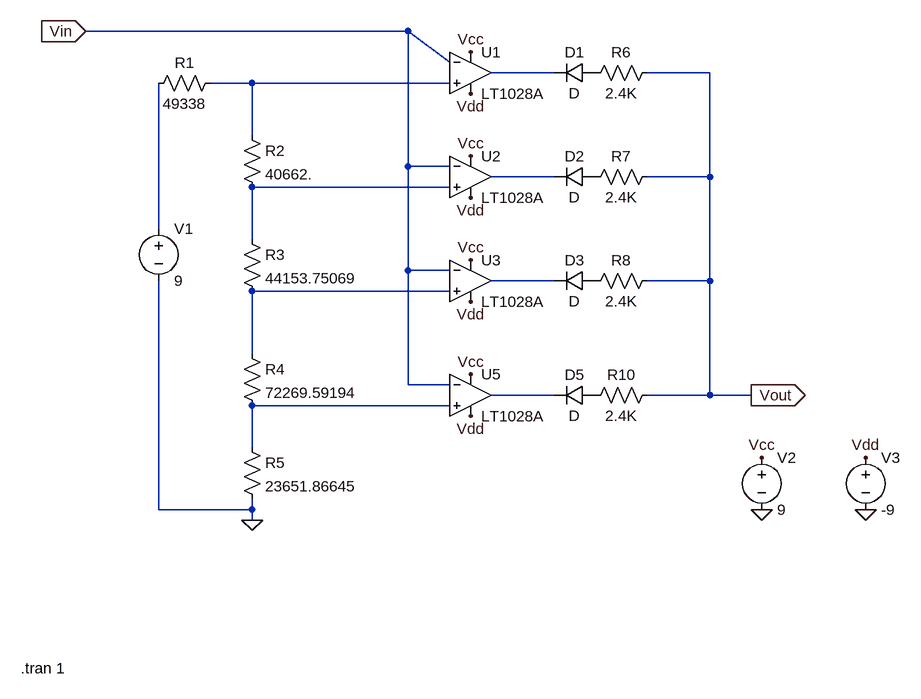
[diagram p0: schematic Komparator.asc]
Komparator.asc, the LTspice schematic file:
Version 4
SHEET 1 1284 996
WIRE 176 0 -320 0
WIRE 240 48 176 0
WIRE 400 64 304 64
WIRE 640 64 544 64
WIRE -64 80 -128 80
WIRE 240 80 -64 80
WIRE -64 160 -64 80
WIRE 176 208 176 0
WIRE 240 208 176 208
WIRE 400 224 304 224
WIRE 640 224 640 64
WIRE 640 224 544 224
WIRE 240 240 -64 240
WIRE -208 304 -208 80
WIRE -64 320 -64 240
WIRE 176 368 176 208
WIRE 240 368 176 368
WIRE 400 384 304 384
WIRE 640 384 640 224
WIRE 640 384 544 384
WIRE 240 400 -64 400
WIRE -64 496 -64 400
WIRE 176 544 176 368
WIRE 240 544 176 544
WIRE 400 560 304 560
WIRE 640 560 640 384
WIRE 640 560 544 560
WIRE 704 560 640 560
WIRE 240 576 -64 576
WIRE -64 640 -64 576
WIRE -208 736 -208 384
WIRE -64 736 -64 720
WIRE -64 736 -208 736
WIRE -64 752 -64 736
FLAG -64 752 0
FLAG -320 0 Vin
IOPIN -320 0 In
FLAG 272 32 Vcc
FLAG 272 192 Vcc
FLAG 272 352 Vcc
FLAG 272 528 Vcc
FLAG 720 656 Vcc
FLAG 272 592 Vdd
FLAG 272 416 Vdd
FLAG 272 256 Vdd
FLAG 272 96 Vdd
FLAG 704 560 Vout
IOPIN 704 560 Out
FLAG 720 736 0
FLAG 880 736 0
FLAG 880 656 Vdd
SYMBOL Opamps\\LT1028A 272 0 R0
SYMATTR InstName U1
SYMBOL Opamps\\LT1028A 272 160 R0
SYMATTR InstName U2
SYMBOL Opamps\\LT1028A 272 320 R0
SYMATTR InstName U3
SYMBOL Opamps\\LT1028A 272 496 R0
SYMATTR InstName U5
SYMBOL voltage -208 288 R0
WINDOW 123 0 0 Left 2
WINDOW 39 0 0 Left 2
SYMATTR InstName V1
SYMATTR Value 9
SYMBOL res -112 64 R90
WINDOW 0 0 56 VBottom 2
WINDOW 3 32 56 VTop 2
SYMATTR InstName R1
SYMATTR Value 49338
SYMBOL res -80 144 R0
SYMATTR InstName R2
SYMATTR Value 40662.
SYMBOL res -80 304 R0
SYMATTR InstName R3
SYMATTR Value 44153.75069
SYMBOL res -80 480 R0
SYMATTR InstName R4
SYMATTR Value 72269.59194
SYMBOL voltage 720 640 R0
WINDOW 123 0 0 Left 2
WINDOW 39 0 0 Left 2
SYMATTR InstName V2
SYMATTR Value 9
SYMBOL voltage 880 640 R0
WINDOW 123 0 0 Left 2
WINDOW 39 0 0 Left 2
SYMATTR InstName V3
SYMATTR Value -9
SYMBOL diode 464 48 R90
WINDOW 0 0 32 VBottom 2
WINDOW 3 32 32 VTop 2
SYMATTR InstName D1
SYMBOL diode 464 208 R90
WINDOW 0 0 32 VBottom 2
WINDOW 3 32 32 VTop 2
SYMATTR InstName D2
SYMBOL diode 464 368 R90
WINDOW 0 0 32 VBottom 2
WINDOW 3 32 32 VTop 2
SYMATTR InstName D3
SYMBOL diode 464 544 R90
WINDOW 0 0 32 VBottom 2
WINDOW 3 32 32 VTop 2
SYMATTR InstName D5
SYMBOL res 560 48 R90
WINDOW 0 0 56 VBottom 2
WINDOW 3 32 56 VTop 2
SYMATTR InstName R6
SYMATTR Value 2.4K
SYMBOL res 560 208 R90
WINDOW 0 0 56 VBottom 2
WINDOW 3 32 56 VTop 2
SYMATTR InstName R7
SYMATTR Value 2.4K
SYMBOL res 560 368 R90
WINDOW 0 0 56 VBottom 2
WINDOW 3 32 56 VTop 2
SYMATTR InstName R8
SYMATTR Value 2.4K
SYMBOL res 560 544 R90
WINDOW 0 0 56 VBottom 2
WINDOW 3 32 56 VTop 2
SYMATTR InstName R10
SYMATTR Value 2.4K
SYMBOL res -80 624 R0
SYMATTR InstName R5
SYMATTR Value 23651.86645
TEXT -420 980 Left 2 !.tran 1

The netlist it stands for:
* Komparator.asc
XU1 N002 Vin Vcc Vdd N001 LT1028A  ; pins In+ In- V+ V- OUT
XU2 N004 Vin Vcc Vdd N003 LT1028A  ; pins In+ In- V+ V- OUT
XU3 N007 Vin Vcc Vdd N006 LT1028A  ; pins In+ In- V+ V- OUT
XU5 N009 Vin Vcc Vdd N008 LT1028A  ; pins In+ In- V+ V- OUT
V1 N005 0 9
R1 N002 N005 49338
R2 N002 N004 40662.
R3 N004 N007 44153.75069
R4 N007 N009 72269.59194
V2 Vcc 0 9
V3 Vdd 0 -9
D1 P001 N001 D
D2 P002 N003 D
D3 P003 N006 D
D5 P004 N008 D
R6 Vout P001 2.4K
R7 Vout P002 2.4K
R8 Vout P003 2.4K
R10 Vout P004 2.4K
R5 N009 0 23651.86645
.model D D
.lib standard.dio
.tran 1
.backanno
.end